# EasyEDA schematic SCH_NIRV2.1_NOMOSFET-REG.json
TITLE: Near Infrared; REV: 1.0; Date: 18/03/2022; Sheet: 1/1; Company: Singapore Polytechnic
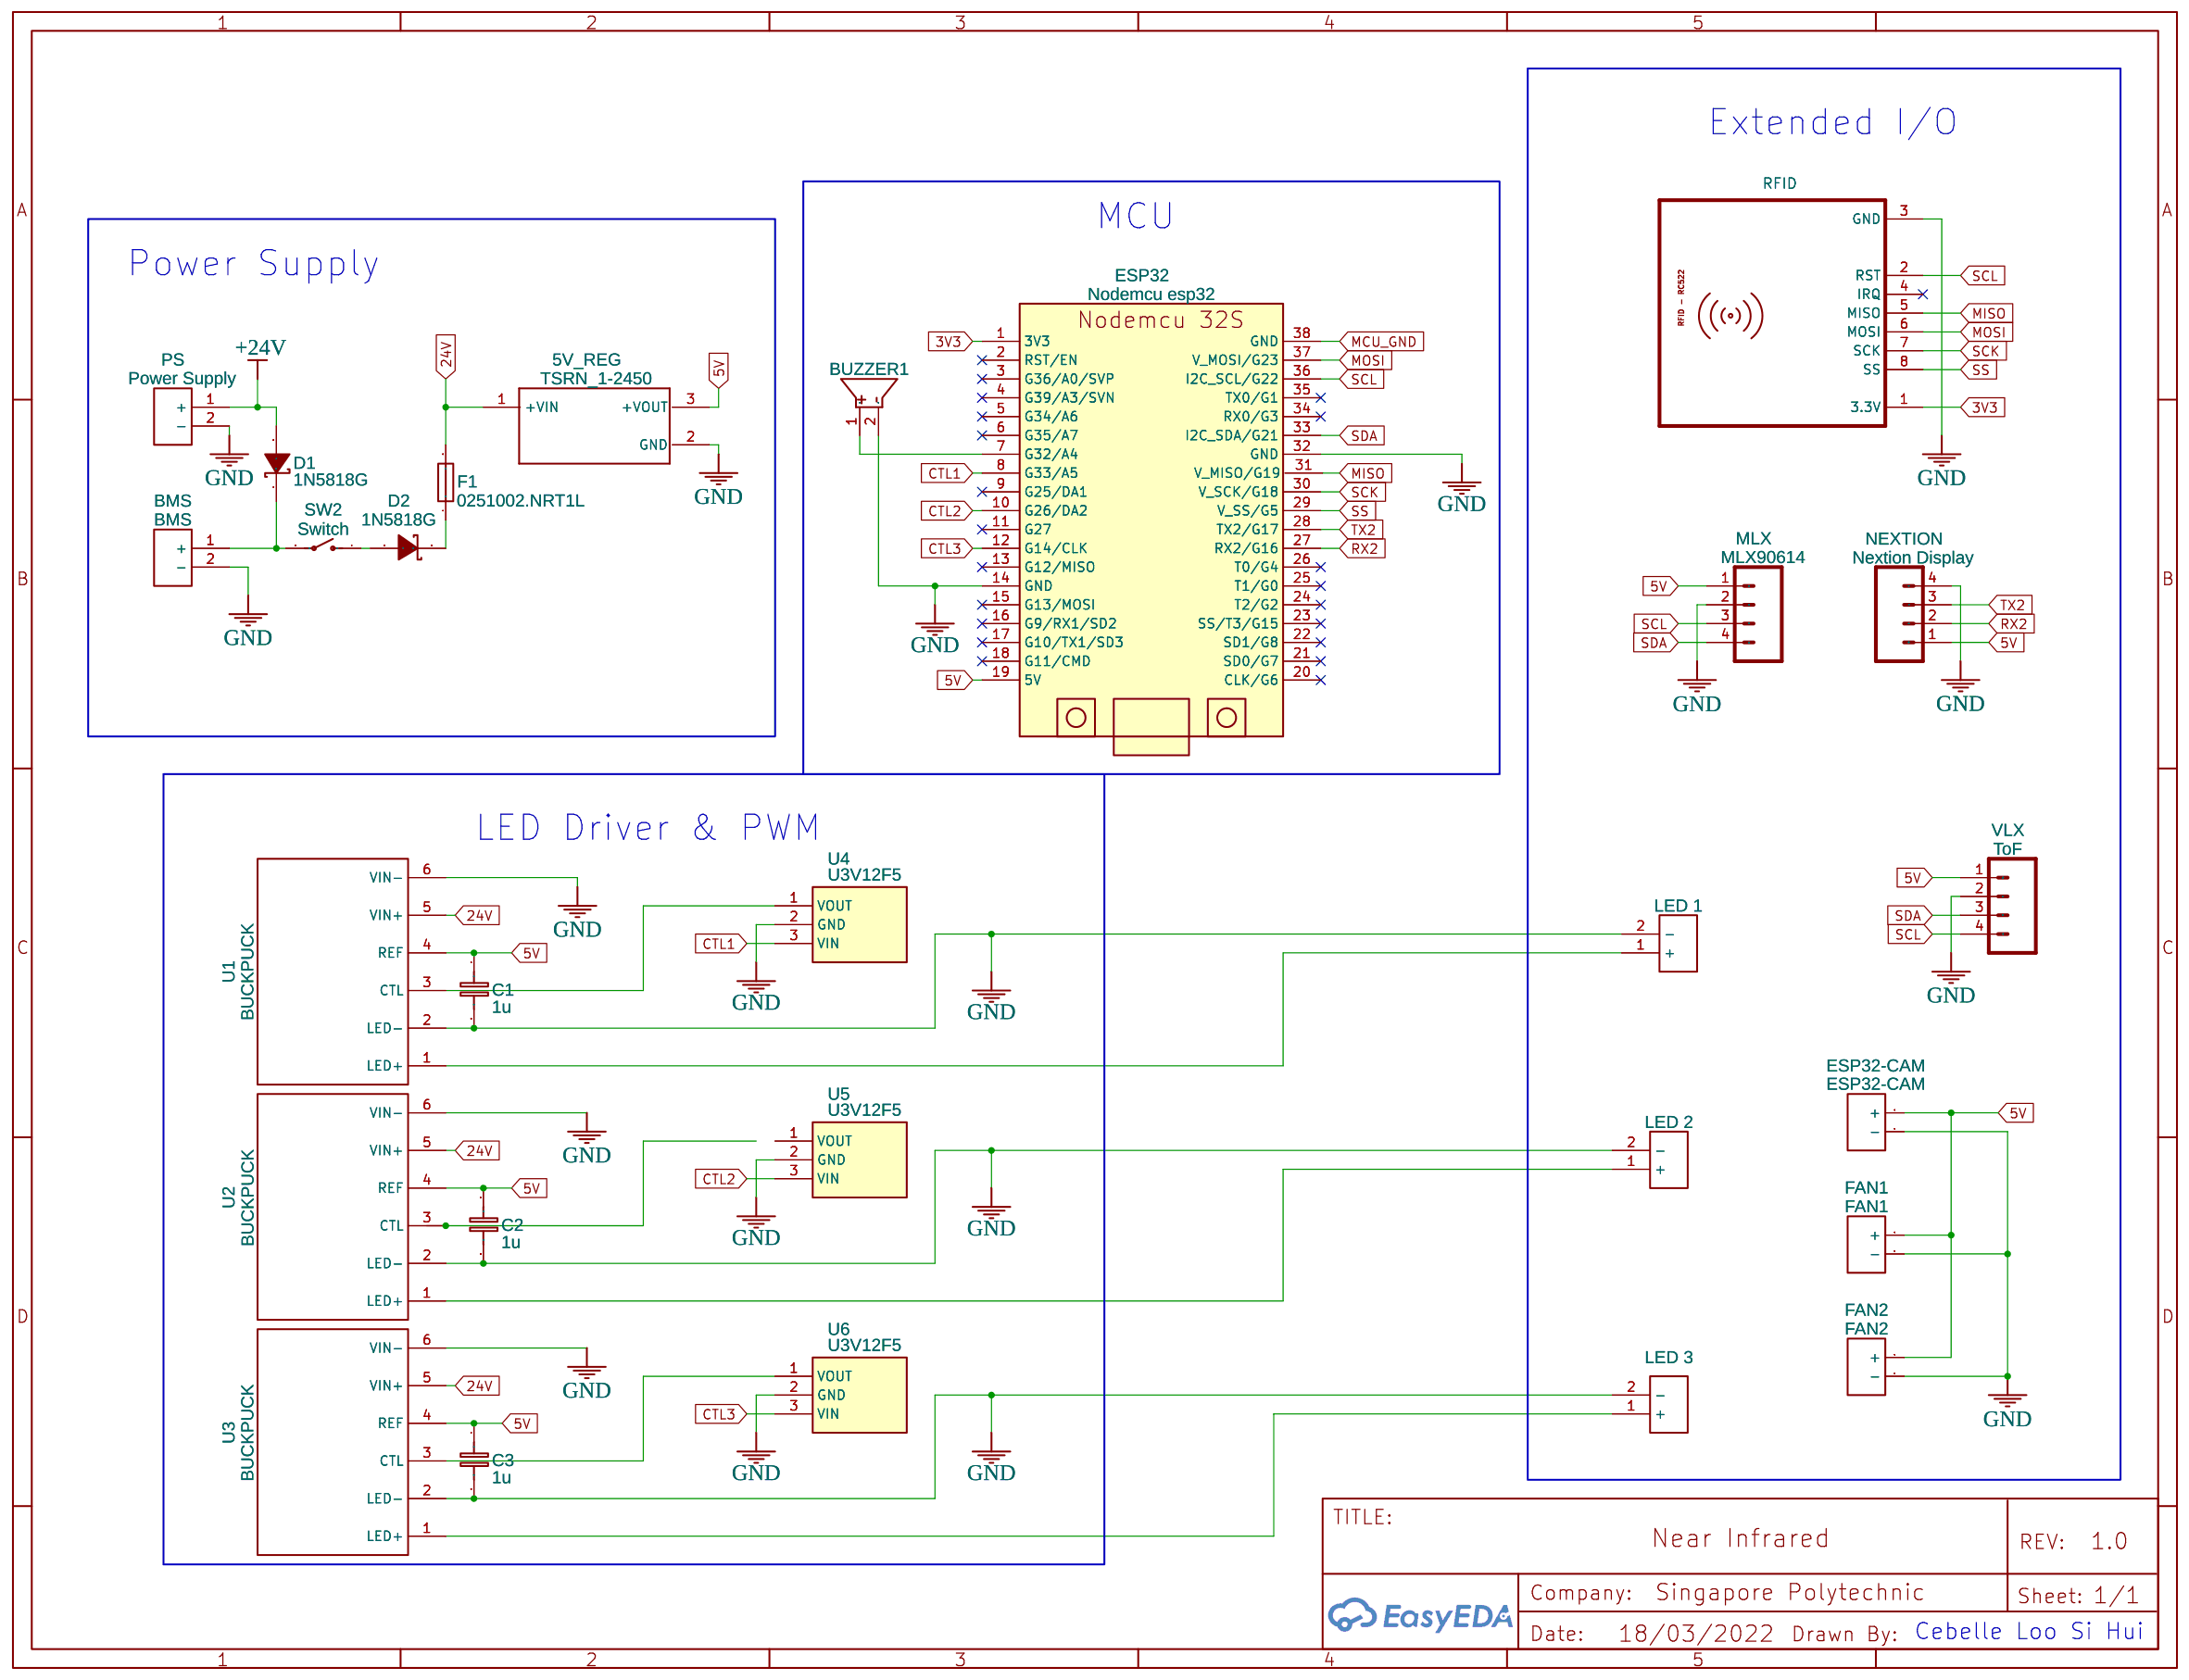
[diagram p0: schematic sheet]

## Parts
5V_REG  TSRN_1-2450  [CONV_TSRN_1-2450]
BMS  BMS  [2PIN-TERMINALBLOCK-5MM]
BUZZER1  FMQ-BUZZER2  [BUZ-TH_BD12.0-P7.60-D0.6-FD]
C1  1u  [CAP-C-0.1]
C2  1u  [CAP-C-0.1]
C3  1u  [CAP-C-0.1]
D1  1N5818G  [DO-15_BD3.1-L6.7-P10.70-D0.9-RD]
D2  1N5818G  [DO-15_BD3.1-L6.7-P10.70-D0.9-RD]
ESP32  Nodemcu esp32  [NODEMCU-ESP32S]
ESP32-CAM  ESP32-CAM  [HDR-TH_2P-P2.54-V-F]
F1  0251002.NRT1L  [FUSE-TH_BD2.8-L7.1-P11.10-D0.9]
FAN1  FAN1  [HDR-TH_2P-P2.54-V-F]
FAN2  FAN2  [HDR-TH_2P-P2.54-V-F]
LED4  LED 1  [2PIN-TERMINALBLOCK-5MM]
LED5  LED 2  [2PIN-TERMINALBLOCK-5MM]
LED6  LED 3  [2PIN-TERMINALBLOCK-5MM]
MLX  MLX90614  [MOLEX-1X4]
NEXTION  Nextion Display  [MOLEX-1X4]
PS  Power Supply  [2PIN-TERMINALBLOCK-5MM]
RFID  NO  [MFRC522 BREAKOUT]
SW2  Switch  [2PIN-TERMINALBLOCK-5MM]
U1  BUCKPUCK  [BUCKPUCK]
U2  BUCKPUCK  [BUCKPUCK]
U3  BUCKPUCK  [BUCKPUCK]
U4  U3V12F5  [U3V12F9]
U5  U3V12F5  [U3V12F9]
U6  U3V12F5  [U3V12F9]
VLX  ToF  [MOLEX-1X4]

## Library data of the parts
5V_REG = TSRN_1-2450: Contributor: jakobaarestrup
BMS LED4 PS = WJ103-5.00-2P: Supplier: LCSC; Manufacturer: ReliaPro; Supplier Part: C8439; JLCPCB Part Class: Extended Part; Package Display: No
BUZZER1 = FMQ-BUZZER2: Supplier: LCSC; Supplier Part: C9900006103; JLCPCB Part Class: Extended Part; Contributor: LCSC
C1-C3 = CAP-C
D1 D2 = 1N5818G: Supplier: LCSC; Supplier Part: C232462; Manufacturer: ON Semicon; Contributor: LCSC; JLCPCB Part Class: Extended Part
ESP32 = Nodemcu esp32: Contributor: SSanya
ESP32-CAM FAN1 FAN2 = Header-Female-2.54_1x2: Supplier: LCSC; Manufacturer: BOOMELE; Manufacturer Part: 2.54-1*2PFemale; Supplier Part: C49661; JLCPCB Part Class: Extended Part
F1 = 0251002.NRT1L: Supplier: LCSC; Supplier Part: C151088; Manufacturer: Littelfuse; Contributor: LCSC; JLCPCB Part Class: Extended Part
LED5 LED6 = WJ103-5.00-2P: Supplier: LCSC; Manufacturer: ReliaPro; Supplier Part: C8439; JLCPCB Part Class: Extended Part
MLX NEXTION VLX = M04POLAR: Header 4; Contributor: SparkFun
SW2 = SWITCH-2P-SPST-Rocker-10x15mm: Manufacturer Part: KCD1-11-1.5x1cm; Supplier: Aliexpress; link: https://www.aliexpress.com/item/32920360920.html?spm=a2g0s.9042311.0.0.27424c4dCPvDQN; Contributor: shaman0
U1-U3 = BUCKPUCK: Contributor: 박종률
U4-U6 = U3V12F5: Contributor: Andrew Walsh; sourceId: YsmgyP7pj

## Nets
3V3: ESP32.1(3V3) RFID.1(3.3V)
5V: 5V_REG.3(+VOUT) C1.1 C2.1 C3.1 ESP32.19(5V) ESP32-CAM.2(+) FAN1.2(+) FAN2.2(+) MLX.1(GND) NEXTION.1(GND) U1.4(REF) U2.4(REF) U3.4(REF) VLX.1(GND)
24V: 5V_REG.1(+VIN) F1.2 U1.5(VIN+) U2.5(VIN+) U3.5(VIN+)
+24V: D1.2(A) PS.1(+)
GND: 5V_REG.2(GND) BMS.2(-) BUZZER1.2 C1.2 C2.2 C3.2 ESP32.14(GND) ESP32.32(GND) ESP32-CAM.1(-) FAN1.1(-) FAN2.1(-) LED4.2(-) LED5.2(-) LED6.2(-) MLX.2(RX) NEXTION.4(+5V) PS.2(-) RFID.3(GND) U1.2(LED-) U1.6(VIN-) U2.2(LED-) U2.6(VIN-) U3.2(LED-) U3.6(VIN-) U4.2(GND) U5.2(GND) U6.2(GND) VLX.2(RX)
CTL1: ESP32.8(G33/A5) U4.3(VIN)
CTL2: ESP32.10(G26/DA2) U5.3(VIN)
CTL3: ESP32.12(G14/CLK) U6.3(VIN)
MCU_GND: ESP32.38(GND)
MISO: ESP32.31(V_MISO/G19) RFID.5(MISO)
MOSI: ESP32.37(V_MOSI/G23) RFID.6(MOSI)
RX2: ESP32.27(RX2/G16) NEXTION.2(RX)
SCK: ESP32.30(V_SCK/G18) RFID.7(SCK)
SCL: ESP32.36(I2C SCL/G22) MLX.3(TX) RFID.2(RST) VLX.4(+5V)
SDA: ESP32.33(I2C SDA/G21) MLX.4(+5V) VLX.3(TX)
SS: ESP32.29(V_SS/G5) RFID.8(SS)
TX2: ESP32.28(TX2/G17) NEXTION.3(TX)
Net-(BMS-1): BMS.1(+) D1.1(C) SW2.2(P)
Net-(BUZZER1-1): BUZZER1.1 ESP32.7(G32/A4)
Net-(D2-1): D2.1(C) F1.1
Net-(D2-2): D2.2(A) SW2.1(O)
Net-(LED4-1): LED4.1(+) U1.1(LED+)
Net-(LED5-1): LED5.1(+) U2.1(LED+)
Net-(LED6-1): LED6.1(+) U3.1(LED+)
Net-(U1-3): U1.3(CTL) U4.1(VOUT)
Net-(U3-3): U3.3(CTL) U6.1(VOUT)

Not connected (* = marked no-connect by the designer): ESP32 2(RST/EN)* 3(G36/A0/SVP)* 4(G39/A3/SVN)* 5(G34/A6)* 6(G35/A7)* 9(G25/DA1)* 11(G27)* 13(G12/MISO)* 15(G13/MOSI)* 16(G9/RX1/SD2)* 17(G10/TX1/SD3)* 18(G11/CMD)* 20(CLK/G6)* 21(SD0/G7)* 22(SD1/G8)* 23(SS/T3/G15)* 24(T2/G2)* 25(T1/G0)* 26(T0/G4)* 34(RX0/G3)* 35(TX0/G1)*; RFID 4(IRQ)*; U2 3(CTL); U5 1(VOUT)

## Notes on the sheet
- Extended I/O
- MCU
- Power Supply
- LED Driver & PWM
- Cebelle Loo Si Hui
